# EAGLE design waveshare.v4 (EAGLE 9.6.2)
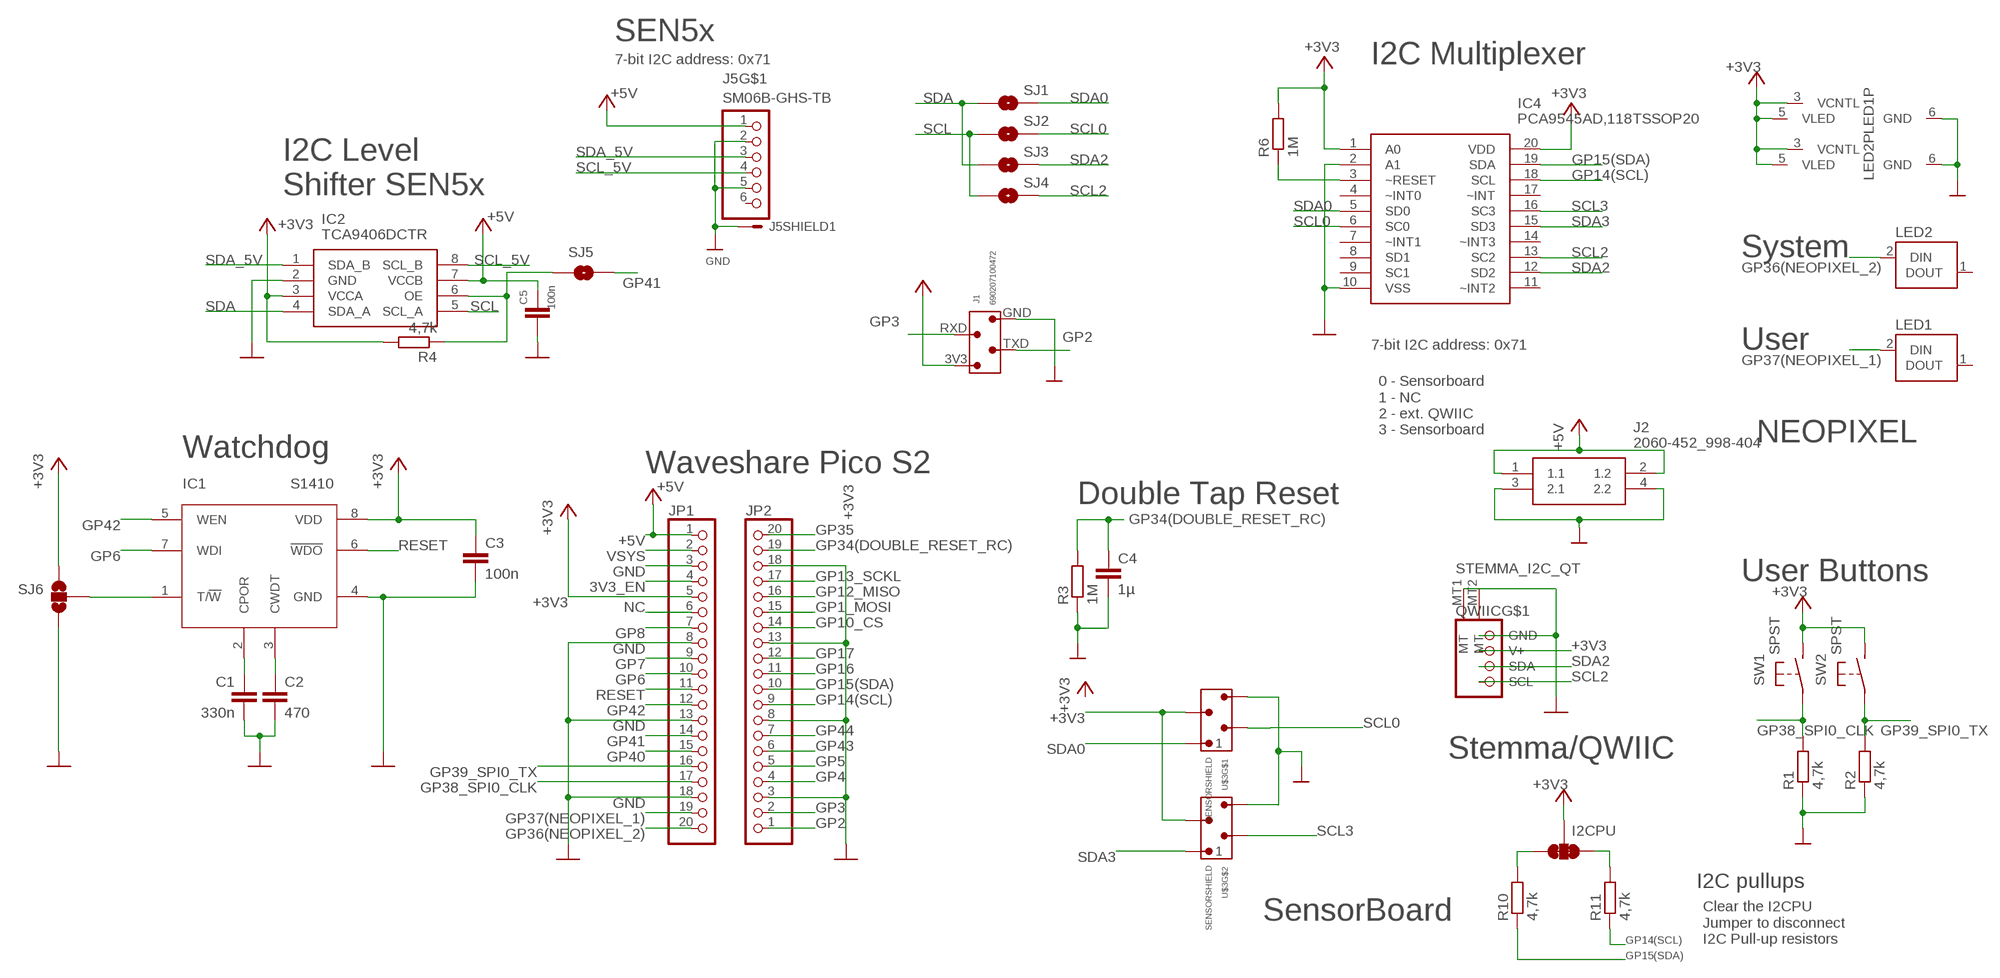
[diagram p0: schematic, sheet 1]

## Parts
C1  330n  C-EUC0603  [C0603]
C2  470  C-EUC0603  [C0603]
C3  100n  C-EUC0603  [C0603]
C4  1µ  C-EUC0603  [C0603]
C5  100n  C-EUC0603  [C0603]
I2CPU  I2C PU  JUMPER-SMT_3_2-NC_TRACE_SILK  [SMT-JUMPER_3_2-NC_TRACE_SILK]
IC1  S1410  [MSOP08]
IC2  TCA9406DCTR  [SOP65P400X130-8N]
IC4  PCA9545AD,118TSSOP20  [TSSOP20]
J1  690207100472  LORASHIELD  [LORASHIELD]
J2  2060-452_998-404  [2060452998404]
J5  SM06B-GHS-TB  JST-PH-06-SMDSMD  [JST-PH-06-SMD]
JP1  PINHD-1X20  [1X20]
JP2  PINHD-1X20  [1X20]
LED1  WS2812WS2812  [WS2812]
LED2  WS2812WS2812  [WS2812]
QWIIC  STEMMA_I2C_QT  [JST_SH4]
R1  4,7k  R-EU_R0603  [R0603]
R2  4,7k  R-EU_R0603  [R0603]
R3  1M  R-EU_R0603  [R0603]
R4  4,7k  R-EU_R0603  [R0603]
R6  1M  R-EU_R0603  [R0603]
R10  4,7k  R-EU_R0603  [R0603]
R11  4,7k  R-EU_R0603  [R0603]
SJ1  SOLDERJUMPERNO  [SJ_2S-NO]
SJ2  SOLDERJUMPERNO  [SJ_2S-NO]
SJ3  SOLDERJUMPERNO  [SJ_2S-NO]
SJ4  SOLDERJUMPERNO  [SJ_2S-NO]
SJ5  SOLDERJUMPERNO  [SJ_2S-NO]
SJ6  SOLDERJUMPER_2WAYTRACE1&2  [SJ_3_TRACE1&2]
SW1  SPST  [DTSM-32S-B]
SW2  SPST  [DTSM-32S-B]
U$3  SENSORSHIELD  [SENSORSHIELD]

## Nets
3V3_EN: JP1.4
+3V3: C3.1 I2CPU.2 IC1.8(VDD) IC2.3(VCCA) IC4.1(A0) IC4.20(VDD) J1.3V3 JP1.5 LED1.3(P:VCNTL) LED1.5(P:VLED) LED2.3(P:VCNTL) LED2.5(P:VLED) QWIIC.2(V+) R4.2 R6.2 SJ6.1 SW1.P$2(S) SW2.P$2(S) U$3.3V3_1 U$3.3V3_2
+5V: C5.1 IC2.7(VCCB) J2.1(1.1) J2.2(1.2) J5.1 JP1.1
GND [lowpower]: C1.2 C2.2 C3.2 C4.2 C5.2 IC1.4(GND) IC2.2(GND) IC4.2(A1) IC4.10(VSS) J1.GND J2.3(2.1) J2.4(2.2) J5.2 J5.5 J5.7(SHIELD1:S) J5.8(SHIELD1:S) JP1.3 JP1.8 JP1.13 JP1.18 JP2.3 JP2.8 JP2.13 JP2.18 LED1.6(P:GND) LED2.6(P:GND) QWIIC.1(GND) QWIIC.MT1(MT) QWIIC.MT2(MT) R1.1 R2.1 R3.1 SJ6.3 U$3.GND_1 U$3.GND_2
GP1_MOSI: JP2.15
GP2: J1.TXD JP2.1
GP3: J1.RXD JP2.2
GP4: JP2.4
GP5: JP2.5
GP6: IC1.7(WDI) JP1.10
GP7: JP1.9
GP8: JP1.7
GP10_CS: JP2.14
GP12_MISO: JP2.16
GP13_SCKL: JP2.17
GP14(SCL): IC4.18(SCL) JP2.9 R11.1
GP15(SDA): IC4.19(SDA) JP2.10 R10.1
GP16: JP2.11
GP17: JP2.12
GP34(DOUBLE_RESET_RC): C4.1 JP2.19 R3.2
GP35: JP2.20
GP36(NEOPIXEL_2): JP1.20 LED2.2( :DIN)
GP37(NEOPIXEL_1): JP1.19 LED1.2( :DIN)
GP38_SPI0_CLK: JP1.17 R1.2 SW1.P$1(P)
GP39_SPI0_TX: JP1.16 R2.2 SW2.P$1(P)
GP40: JP1.15
GP41: JP1.14 SJ5.2
GP42: IC1.5(WEN) JP1.12
GP43: JP2.6
GP44: JP2.7
N$1: IC2.6(OE) R4.1 SJ5.1
N$5: C1.1 IC1.2(CPOR)
N$6: C2.1 IC1.3(CWDT)
N$7: IC1.1(T/!W) SJ6.2
N$8: IC4.3(~RESET) R6.1
N$9: I2CPU.3 R10.2
N$10: I2CPU.1 R11.2
NC: JP1.6
RESET: IC1.6(!WDO) JP1.11
SCL: IC2.5(SCL_A) SJ2.1 SJ4.1
SCL0: IC4.6(SC0) SJ2.2 U$3.SCL0
SCL2: IC4.13(SC2) QWIIC.4(SCL) SJ4.2
SCL3: IC4.16(SC3) U$3.SCL1
SCL_5V: IC2.8(SCL_B) J5.4
SDA: IC2.4(SDA_A) SJ1.1 SJ3.1
SDA0: IC4.5(SD0) SJ1.2 U$3.SDA0
SDA2: IC4.12(SD2) QWIIC.3(SDA) SJ3.2
SDA3: IC4.15(SD3) U$3.SDA1
SDA_5V: IC2.1(SDA_B) J5.3
VSYS: JP1.2
Unconnected: IC4.4(~INT0) IC4.7(~INT1) IC4.8(SD1) IC4.9(SC1) IC4.11(~INT2) IC4.14(~INT3) IC4.17(~INT) J5.6 LED1.1( :DOUT) LED2.1( :DOUT)

## Notes on the sheet
- SEN5x
- 7-bit I2C address: 0x71 | I2C Multiplexer
- I2C Level
  Shifter SEN5x
- System
- 7-bit I2C address: 0x71 | User
- 0 - Sensorboard
  1 - NC
  2 - ext. QWIIC
  3 - Sensorboard
- NEOPIXEL
- Watchdog
- Waveshare Pico S2
- Double Tap Reset
- User Buttons
- Stemma/QWIIC
- I2C pullups
- SensorBoard
- Clear the I2CPU 
  Jumper to disconnect
  I2C Pull-up resistors

## Library data of the parts
C1-C5 = rcl:C-EU: CAPACITOR, European symbol; SPICEPREFIX: C
I2CPU = SparkFun-Jumpers:JUMPER-SMT_3_2-NC_TRACE: Normally closed trace jumper (2 of 2 connections) This jumper has a trace between all three pads so they are normally closed (NC). Use a razor knife to open the connection(s). For best results follow the IPC guidelines for cutting traces: Cutout at least 0.063 mm (0.005 in). Remove all loose material to clean up the cut area. Seal the cut with an approved epoxy. Reapply solder to reclose the connection(s).
IC1 = S1410:S1410
IC2 = SamacSys_Parts:TCA9406DCTR: 2-Bit Bidirectional 1-MHz I2C Bus and SMBus Voltage-Level Shifter Source: Datasheet <http://www.ti.com/lit/ds/symlink/tca9406.pdf>; DESCRIPTION: 2-Bit Bidirectional 1-MHz I2C Bus and SMBus Voltage-Level Shifter; HEIGHT: 1.3mm; MANUFACTURER_NAME: Texas Instruments; MANUFACTURER_PART_NUMBER: TCA9406DCTR; MOUSER_PART_NUMBER: 595-TCA9406DCTR; MOUSER_PRICE-STOCK: https://www.mouser.co.uk/ProductDetail/Texas-Instruments/TCA9406DCTR?qs=Ze4%2FuFuz19L6Yntu0RTUyw%3D%3D
IC4 = HSW_ATM-IC:PCA9545AD,118: 4-channel I2C-bus switch with interrupt logic and reset Source: Datasheet
J1 = LoRaShieldE5:LORASHIELD: WR-MM Transition Connector KIND PROPERTIES: Pitch 2.54 mm Gender:Transition MATERIAL PROPERTIES: Insulator Material:PBT Insulator Flammability Rating UL94 V-0 Insulator Color:Red Contact Material :Phosphor Bronze Contact Plating :Mat Tin over Nickel Contact Type: Stamped GENERAL PROPERTIES: Operating Temperature:-40 °C up to +105 °C Compliance Lead free / RoHS ELECTRICAL PROPERTIES: IR 1:1 A Working Voltage 100 V (AC) Withstanding Voltage:500 V (AC) Contact Resistance: 10 mΩ Insulation Resistance:1000 MΩ PACKAGING PROPERTIES: cULus Approval:E323964 Packaging :Tube <https://katalog.we-online.com/media/images/v2/o33156v209%20Family_WR-MM_69020710xx72.jpg> Details see: https://katalog.we-online.com/en/em/MM_TRANSITION_CONNECTOR_69020710XX72 Updated by Yingchun,Shan 2019-10-28 2019 (C) Würth Elektronik; CONTACT-RESISTANCE: 10mOhm; DATASHEET-URL: https://www.we-online.com/catalog/datasheet/690207100472.pdf; GENDER: Transition; IR: 1A; L: 8.51mm; PACKAGING: Tube; PART-NUMBER: 690207100472; PINS: 4; PITCH: 2.54; TYPE: Straight; WORKING-VOLTAGE: 100V(AC)
J2 = 2060-452_998-404:2060-452_998-404: SMD PCB terminal block; push-button; 0.75 mm; Pin spacing 4 mm; 2-pole; Push-in CAGE CLAMP; in tape-and-reel packaging Source: Datasheet <https://www.wago.com/2060-452/998-404>; ARROW_PART_NUMBER: 2060-452/998-404; ARROW_PRICE-STOCK: https://www.arrow.com/en/products/2060-452998-404/wago-kontakttechnik-gmbh?region=nac; DESCRIPTION: SMD PCB terminal block; push-button; 0.75 mm; Pin spacing 4 mm; 2-pole; Push-in CAGE CLAMP; in tape-and-reel packaging; HEIGHT: 4.5mm; MANUFACTURER_NAME: Wago; MANUFACTURER_PART_NUMBER: 2060-452/998-404
J5 = HSW_ATM-Connector_JST:JST-PH-06-SMD
JP1 JP2 = pinhead:PINHD-1X20: PIN HEADER
LED1 LED2 = WS2812:WS2812
QWIIC = microbuilder:STEMMA_I2C
R1-R4 R6 R10 R11 = rcl:R-EU_: RESISTOR, European symbol; SPICEPREFIX: R
SJ1-SJ5 = HSW_ATM-Passives:SOLDERJUMPER: Solder Jumper Standard SMD solder jumper. Used to automate production. Two varients : Normally Open and Normally Closed are the same, but have different paste layers. NC will have a large amount of paste and should jumper during reflow.
SJ6 = HSW_ATM-Passives:SOLDERJUMPER_2WAY: Solder Jumper 2 way solder jumper
SW1 SW2 = HSW_ATM-Passives:SPST
U$3 = sensorshield:SENSORSHIELD

## Net classes
1 highpower: width 0.406 mm, drill 0.483 mm
2 lowpower: width 0.152 mm, drill 0.3 mm

## Board
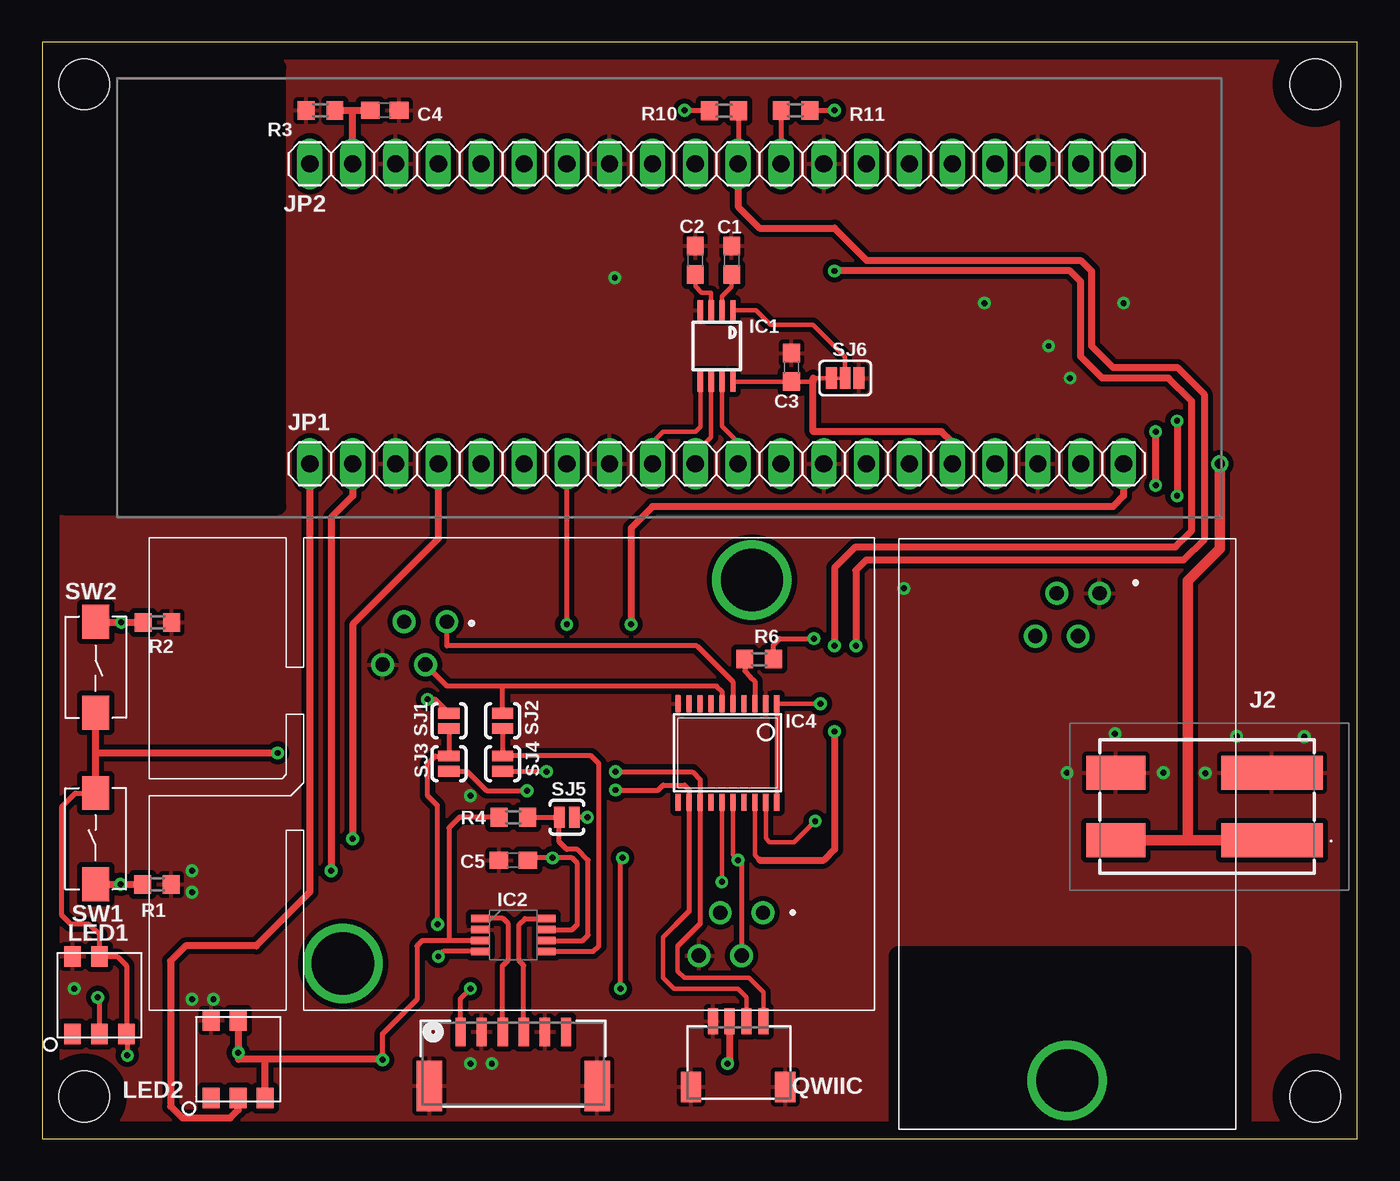
[diagram p1: board, top side]
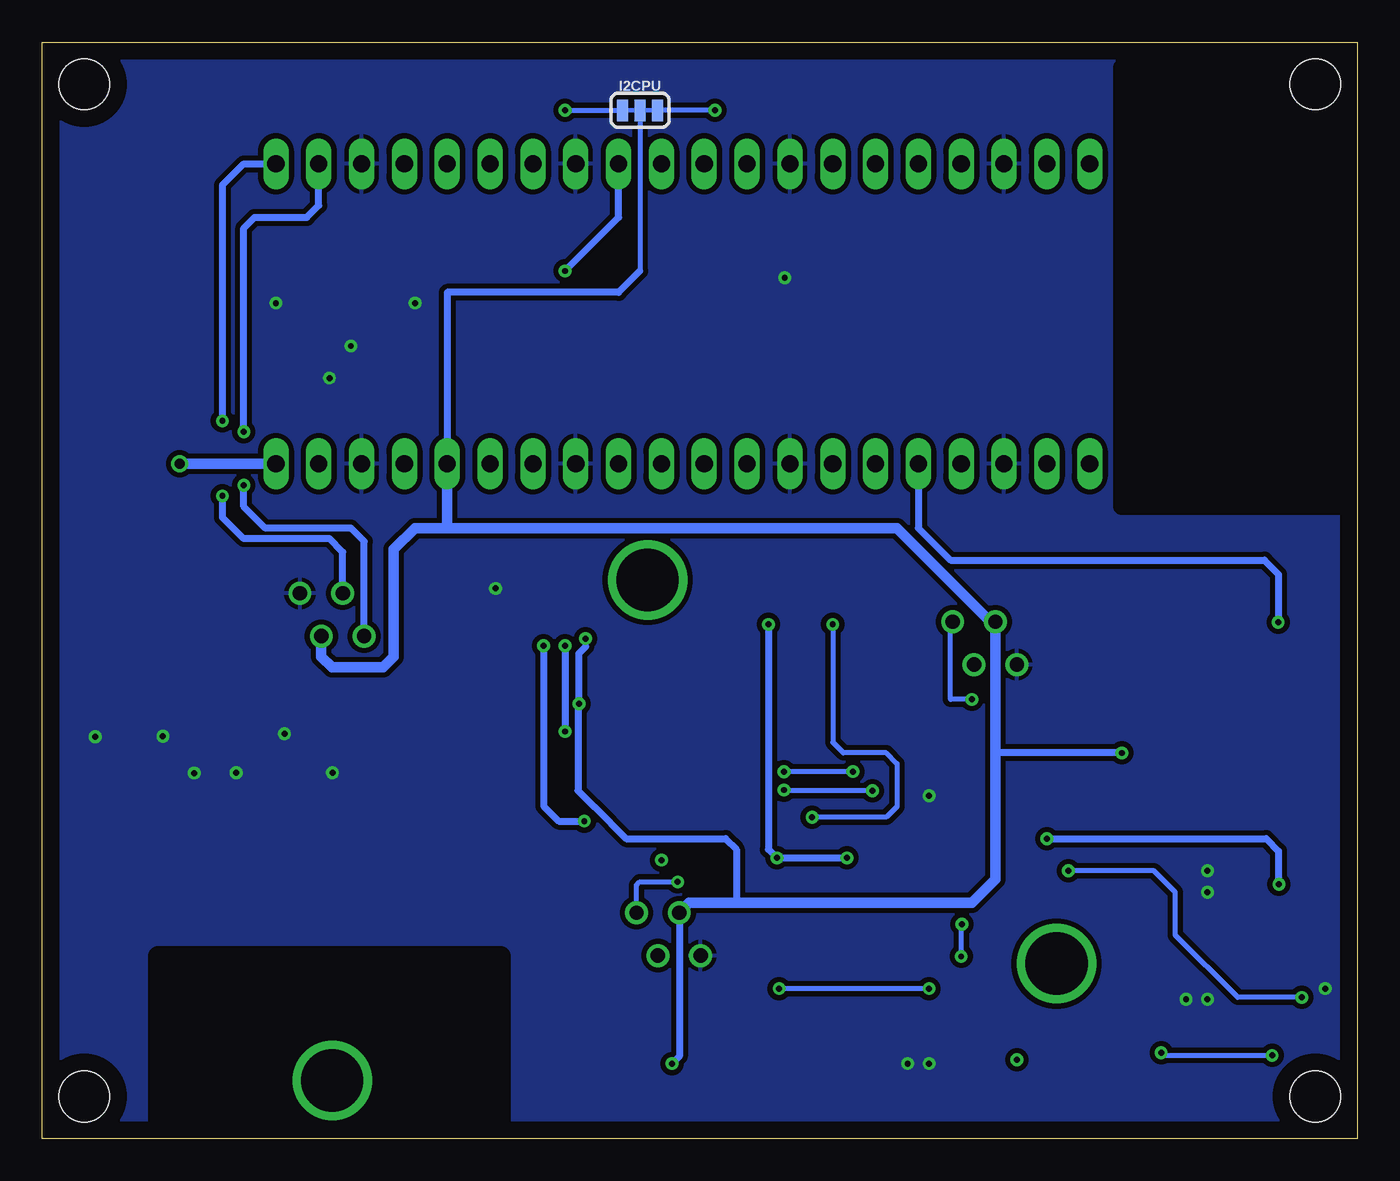
[diagram p2: board, bottom side, seen from below]

Size 78 x 65 mm. Coordinates in mm from the lower left corner, seen from the top.
Outline: 0,0 78,0 78,65 0,65 0,0
Copper layers (1*16): Top 0.035mm / dielectric 1.5mm / Bottom 0.035mm
Design rules "default *": minimum track width 3mil, minimum drill 0.3mm, track to track 6mil, track to pad 6mil, pad to pad 6mil, via to via 6mil, smd to smd 6mil, copper to edge 40mil, drill to drill 6mil, minimum pad ring 10mil, minimum via ring 8mil, stop-mask expansion 4mil, vias tented up to drill 0.3mm, thermal gap 10mil
Holes 3 mm at 2.5,2.5 75.5,2.5 75.5,62.5 2.5,62.5
tRestrict: area 1.3,37.5 to 14,63.5; area 50.8,0.6 to 71.1,10.8
bRestrict: area 1.3,37.5 to 14,63.5; area 50.8,0.6 to 71.1,10.8

### Footprints (pad centres in the part's own frame; a part is rotated, then mirrored left to right if it is on the bottom)
C0603 = smd 1.1 x 1: 1 -0.85,0; 2 0.85,0
SMT-JUMPER_3_2-NC_TRACE_SILK = smd 0.66 x 1.27: 1 -1.041,0; 2 0,0; 3 1.041,0
MSOP08 = smd 0.3 x 1.2: 1 -0.976,-2.113; 2 -0.326,-2.113; 3 0.324,-2.113; 4 0.974,-2.113; 5 0.974,2.112; 6 0.324,2.112; 7 -0.326,2.112; 8 -0.976,2.112
SOP65P400X130-8N = smd 1.1 x 0.45: 1 -1.95,0.975; 2 -1.95,0.325; 3 -1.95,-0.325; 4 -1.95,-0.975; 5 1.95,-0.975; 6 1.95,-0.325; 7 1.95,0.325; 8 1.95,0.975
TSSOP20 = smd 0.305 x 0.991: 1 -2.925,-2.918; 2 -2.275,-2.918; 3 -1.625,-2.918; 4 -0.975,-2.918; 5 -0.325,-2.918; 6 0.325,-2.918; 7 0.975,-2.918; 8 1.625,-2.918; 9 2.275,-2.918; 10 2.925,-2.918; 11 2.925,2.918; 12 2.275,2.918; 13 1.625,2.918; 14 0.975,2.918; 15 0.325,2.918; 16 -0.325,2.918; 17 -0.975,2.918; 18 -1.625,2.918; 19 -2.275,2.918; 20 -2.925,2.918
LORASHIELD = drill 0.85: 3V3 5.773,10.642; GND 3.233,11.912; RXD 5.773,8.102; TXD 3.233,9.372 | drill 3.7: P$1 32.111,10
2060452998404 = smd 6 x 2: 1 -3.725,2; 3 -3.725,-2 | smd 3.5 x 2: 2 5.525,2; 4 5.525,-2
JST-PH-06-SMD = smd 0.61 x 1.702: 1 -3.125,1.876; 2 -1.875,1.876; 3 -0.625,1.876; 4 0.625,1.876; 5 1.875,1.876; 6 3.125,1.876 | smd 1.5 x 3: 7 -4.975,-1.324; 8 4.975,-1.324
1X20 = drill 1.016 long: 1 -24.13,0; 2 -21.59,0; 3 -19.05,0; 4 -16.51,0; 5 -13.97,0; 6 -11.43,0; 7 -8.89,0; 8 -6.35,0; 9 -3.81,0; 10 -1.27,0; 11 1.27,0; 12 3.81,0; 13 6.35,0; 14 8.89,0; 15 11.43,0; 16 13.97,0; 17 16.51,0; 18 19.05,0; 19 21.59,0; 20 24.13,0
WS2812 = smd 1.2 x 1: 1 -2.3,1.6; 2 -2.3,0; 3 -2.3,-1.6; 5 2.3,0; 6 2.3,1.6
JST_SH4 = smd 0.6 x 1.55: 1 -1.5,2.514; 2 -0.5,2.514; 3 0.5,2.514; 4 1.5,2.514 | smd 1.2 x 1.8: MT1 -2.8,-1.386; MT2 2.8,-1.386
R0603 = smd 1 x 1.1: 1 -0.85,0; 2 0.85,0
SJ_2S-NO = smd 0.635 x 1.27: 1 -0.45,0; 2 0.45,0
SJ_3_TRACE1&2 = smd 0.635 x 1.27: 1 -0.813,0; 2 0,0; 3 0.813,0
DTSM-32S-B = smd 2 x 1.6: P$1 -2.7,0; P$2 2.7,0
SENSORSHIELD = drill 0.85: 3V3_1 15.113,23.019; 3V3_2 33.864,5.77; GND_1 13.843,20.479; GND_2 32.594,3.23; SCL0 16.383,20.479; SCL1 35.134,3.23; SDA0 17.653,23.019; SDA1 36.404,5.77 | drill 3.7: P$1 11.496,2.75; P$2 35.746,25.5

### Placement (x,y rotation side)
C1  40.89,52.07 90 top
C2  38.73,52.07 90 top
C3  44.45,45.72 90 top
C4  20.32,60.96 0 top
C5  27.94,16.51 180 top
I2CPU  42.55,60.96 0 bottom
IC1  40.01,46.99 180 top
IC2  27.94,12.06 0 top
IC4  40.64,22.86 180 top
J1  50.8,35.56 270 top
J2  69.22,19.68 180 top
J5  27.94,4.45 0 top
JP1  40.01,40.01 180 top
JP2  40.01,57.78 180 top
LED1  3.4,8.5 90 top
LED2  11.63,4.7 90 top
QWIIC  41.27,4.45 0 top
R1  6.81,15.06 180 top
R2  6.83,30.61 180 top
R3  16.51,60.96 0 top
R4  27.94,19.05 180 top
R6  42.52,28.42 0 top
R10  40.44,60.93 180 top
R11  44.68,60.96 0 top
SJ1  24.13,24.77 90 top
SJ2  27.3,24.77 90 top
SJ3  24.13,22.23 270 top
SJ4  27.3,22.23 270 top
SJ5  31.11,19.05 0 top
SJ6  47.62,45.09 0 top
SW1  3.17,17.78 90 top
SW2  3.17,27.94 270 top
U$3  6.35,7.62 0 top

### Tracks (layer width: path | path; a pad name or v marks a point on that pad's centre or on a via)
+3V3  (via drill 0.35)
  Top 0.254: IC1.8 C3.1 45.72,44.87 | 45.72,45.09 SJ6.1 | v46.16,25.78 IC4.1 IC4.20
  Top 0.305: 13.23,4.67 13.21,4.7 | IC2.3 24.13,11.74 | 24.13,11.74 22.54,11.74 22.23,11.43 22.23,8.26 20.17,6.2 20.17,4.7 | R6.2 43.37,29.27 43.74,29.64 v45.77,29.64 | SW1.P$2 1.96,20.48 1.17,19.68 1.17,13.23 1.7,12.7 2.77,12.7 3.4,12.07 LED1.5 4.44,10.8 5,10.24 LED1.3 5.05,6.14 v5.05,4.93 | 24.13,11.74 24.13,18.41 24.77,19.05 R4.2
  Top 0.406: JP1.5 53.98,41.27 53.34,41.91 45.72,41.91 45.72,44.87 45.72,45.09 | SW1.P$2 3.17,22.86 | 3.17,22.86 SW2.P$2 | LED2.5 v11.63,5.08 11.63,4.7 13.21,4.7 20.17,4.7 v20.19,4.67 | LED2.3 13.23,4.67 | 3.17,22.86 v13.97,22.86 | QWIIC.2 40.77,4.58 v40.64,4.45
  Bottom 0.305: v45.77,29.64 45.77,29.16 | I2CPU.2 42.55,51.44 | v5.05,4.93 11.48,4.93 v11.63,5.08
  Bottom 0.406: JP1.5 53.98,50.16 43.81,50.16 42.55,51.44 | 45.77,29.16 46.16,28.77 v46.16,25.78 46.23,25.72 46.23,20.62 45.26,19.66 45.24,19.66 43.36,17.78 37.47,17.78 36.83,17.14 36.83,13.97 | v13.97,22.86 21.46,22.86 | U$3.3V3_2 40.21,4.87 v40.64,4.45
  Bottom 0.61: JP1.5 53.98,36.2 | U$3.3V3_2 39.63,13.97 36.83,13.97 22.86,13.97 21.46,15.37 21.46,22.86 U$3.3V3_1 21.75,30.64 27.3,36.2 53.98,36.2 | 53.98,36.2 55.88,36.2 57.15,34.92 57.15,28.57 57.78,27.94 60.81,27.94 61.44,28.57 J1.3V3
+5V  (via drill 0.35, 0.6)
  Top 0.305: IC2.7 31.44,12.39 31.75,12.7 31.75,16.31 31.42,16.64 v30.28,16.64 28.92,16.64 C5.1 | J5.1 24.82,8.3 v25.4,8.89 | v34.29,8.89 34.29,16.64 v34.42,16.64
  Top 0.406: JP1.1 64.14,38.1 63.5,37.47 36.2,37.47 34.92,36.2 v34.92,30.48
  Top 0.61: J2.1 67.94,17.68 | 67.94,17.68 J2.2 | 67.94,17.68 67.94,33.07 69.85,34.98 v69.85,40.01
  Bottom 0.305: v25.4,8.89 v34.29,8.89
  Bottom 0.406: v34.92,30.48 34.92,17.14 v34.42,16.64 v30.28,16.64
  Bottom 0.61: JP1.1 v69.85,40.01
GND  (via drill 0.35)
  other vias: 64.14,49.53 60.96,45.09 55.88,49.53 59.69,46.99 51.1,32.61 33.96,51.03 25.4,20.32 1.91,8.89 8.89,15.88 8.89,14.61 10.16,8.26 8.89,8.26 25.4,4.45 26.67,4.45 66.5,21.69 68.99,21.67 63.63,24 70.84,23.85 74.85,23.83 60.78,21.69
  pour Top (isolate 0.305): 0,0 79.38,0 79.38,66.04 0,66.04
  pour Bottom (isolate 0.305): 0,0 80.64,0 80.64,65.41 0,65.41
GP2  (via drill 0.35)
  Top 0.406: v67.31,42.55 v67.31,38.1
  Bottom 0.406: J1.TXD 60.17,34.77 60.96,35.56 66.04,35.56 67.31,36.83 v67.31,38.1 | JP2.1 66.04,57.78 67.31,56.52 v67.31,42.55
GP3  (via drill 0.35)
  Top 0.406: v66.04,38.73 v66.04,41.91
  Bottom 0.406: J1.RXD 58.9,35.41 59.69,36.2 64.77,36.2 66.04,37.47 v66.04,38.73 | JP2.2 61.59,55.32 62.31,54.61 65.41,54.61 66.04,53.98 v66.04,41.91
GP6
  Top 0.254: IC1.7 40.33,42.22 41.27,41.27 JP1.10
GP14(SCL)  (via drill 0.35)
  Top 0.254: IC4.18 42.27,16.79 42.55,16.51
  Top 0.305: R11.1 43.83,57.8 JP2.9
  Top 0.406: v46.99,51.44 60.96,51.44 61.59,50.8 61.59,46.35 62.87,45.09 66.8,45.09 68.17,43.71 68.17,36.04 67.21,35.08 48.23,35.08 46.99,33.83 v46.99,29.21 | v46.99,24.13 46.99,17.14 46.35,16.51 42.55,16.51
  Bottom 0.406: v46.99,51.44 43.81,54.61 JP2.9 | v46.99,29.21 v46.99,24.13
GP15(SDA)  (via drill 0.35)
  Top 0.254: IC4.19 42.91,17.79 43.13,17.58 44.6,17.58 v45.85,18.82
  Top 0.305: R10.1 41.29,57.8 JP2.10
  Top 0.406: JP2.10 41.27,55.24 42.55,53.98 46.99,53.98 48.9,52.07 61.59,52.07 62.23,51.44 62.23,46.99 63.5,45.72 67.31,45.72 68.91,44.12 68.91,35.51 67.69,34.29 48.87,34.29 48.26,33.68 v48.26,29.21
  Bottom 0.406: v48.26,29.21 48.26,19.71 47.37,18.82 v45.85,18.82
GP34(DOUBLE_RESET_RC)
  Top 0.406: R3.2 18.41,60.96 | 18.41,60.96 C4.1 | JP2.19 18.41,60.96
GP36(NEOPIXEL_2)
  Top 0.406: JP1.20 15.88,14.61 12.7,11.43 8.51,11.43 7.62,10.54 7.62,1.91 8.31,1.22 11.15,1.22 11.63,1.7 LED2.2
GP37(NEOPIXEL_1)  (via drill 0.35)
  Top 0.305: LED1.2 3.4,8.25 3.4,8.26 v3.29,8.37
  Top 0.406: JP1.19 18.41,38.1 17.14,36.83 v17.14,15.88
  Bottom 0.305: v3.29,8.37 7.1,8.37 10.79,12.06 10.79,14.61 12.06,15.88 v17.14,15.88
GP38_SPI0_CLK  (via drill 0.35)
  Top 0.406: SW1.P$1 v4.65,15.08 5.94,15.08 R1.2 | JP1.17 23.5,35.56 18.41,30.48 v18.41,17.78
  Bottom 0.406: v18.41,17.78 5.41,17.78 4.67,17.04 4.67,15.06 v4.65,15.08
GP39_SPI0_TX  (via drill 0.35)
  Top 0.406: R2.2 v4.7,30.61 3.21,30.61 SW2.P$1
  Bottom 0.406: JP1.16 26.04,36.2 24.13,34.29 5.51,34.29 4.67,33.45 4.67,30.63 v4.7,30.61
GP41  (via drill 0.35)
  Top 0.305: JP1.14 v31.11,30.48 | v32.34,19.05 SJ5.2
  Bottom 0.305: v31.11,30.48 31.11,23.5 30.48,22.86 27.94,22.86 27.3,22.23 27.3,19.68 27.94,19.05 v32.34,19.05 32.38,19.05
GP42
  Top 0.254: IC1.5 39.03,42.21 38.73,41.91 36.83,41.91 36.2,41.27 JP1.12
N$1
  Top 0.305: R4.1 SJ5.1 30.66,17.59 31.11,17.14 31.75,17.14 32.38,16.51 32.38,12.06 32.06,11.74 IC2.6
N$5
  Top 0.254: IC1.2 40.33,49.94 40.89,50.51 C1.1
N$6
  Top 0.254: IC1.3 39.68,50.15 39.12,50.15 39.12,50.14 38.73,50.52 C2.1
N$7
  Top 0.254: IC1.1 42.34,49.1 43.18,48.26 45.72,48.26 47.62,46.35 SJ6.2
N$8
  Top 0.305: IC4.3 42.27,27.11 41.99,27.39 41.67,27.71 R6.1
N$9  (via drill 0.35)
  Top 0.305: R10.2 38.12,60.94 v38.1,60.96
  Bottom 0.305: v38.1,60.96 I2CPU.3
N$10  (via drill 0.35)
  Top 0.305: R11.2 v46.99,60.96
  Bottom 0.305: v46.99,60.96 I2CPU.1
RESET
  Top 0.254: IC1.6 39.68,41.59 38.73,40.64 JP1.11
SCL
  Top 0.305: SJ2.1 SJ4.1 27.31,22.68 32.56,22.68 33.02,22.23 33.02,11.43 32.68,11.09 IC2.5
SCL0
  Top 0.305: IC4.6 40.31,26.51 40.01,26.82 27.3,26.82 | 27.3,26.82 24.01,26.82 U$3.SCL0 | SJ2.2 27.3,26.82
SCL2  (via drill 0.35)
  Top 0.254: 37.7,11.4 37.7,9.93 38.1,9.53 41.91,9.53 42.77,8.66 QWIIC.4
  Top 0.305: 37.7,11.4 39.02,12.72 IC4.13 39.02,21.29 38.56,21.74 v34.01,21.74 | SJ4.2 29.91,21.77 v29.92,21.77 v29.91,21.75
  Bottom 0.305: v29.91,21.75 33.9,21.75 33.96,21.69 v34.01,21.74
SCL3  (via drill 0.35)
  Top 0.254: IC4.16 40.97,16.82 v41.27,16.51
  Top 0.305: v41.27,16.51 41.48,16.3 U$3.SCL1
SCL_5V
  Top 0.305: J5.4 28.57,10.27 28.3,10.54 28.3,12.7 28.64,13.04 IC2.8
SDA  (via drill 0.35)
  Top 0.305: SJ1.1 SJ3.1 23.31,22.68 22.86,22.23 22.86,20.32 23.45,19.73 v23.45,12.7 | IC2.4 23.79,11.09 v23.5,10.79
  Bottom 0.305: v23.5,10.79 23.5,12.7 v23.45,12.7
SDA0  (via drill 0.35)
  Top 0.305: IC4.5 40.97,27.08 38.84,29.21 24,29.21 U$3.SDA0 | SJ1.2 23.31,26.04 v22.86,26.04
  Bottom 0.305: v22.86,26.04 24.13,26.04 24.13,30.51 U$3.SDA0
SDA2  (via drill 0.35)
  Top 0.254: 37.57,12.67 36.83,11.94 36.83,9.53 37.47,8.89 41.27,8.89 41.77,8.39 QWIIC.3
  Top 0.305: 37.57,12.67 38.37,13.47 IC4.12 38.37,20.69 38.1,20.95 36.83,20.95 36.54,20.66 v34,20.66 | SJ3.2 25.21,21.77 26.36,20.62 v28.75,20.62
  Bottom 0.305: v28.75,20.62 33.98,20.62 34.01,20.65 v34,20.66
SDA3  (via drill 0.35)
  Top 0.254: v40.31,15.21 v40.31,15.22 IC4.15
  Bottom 0.305: U$3.SDA1 42.75,15.03 42.57,15.21 v40.31,15.21
SDA_5V
  Top 0.305: J5.3 27.3,6.33 27.3,10.24 27.66,10.59 27.66,12.72 27.33,13.06 26.01,13.06 IC2.1

### Text on the board
tDocu: Waveshare / ESP32-S2 LCD | - | + | LoRa E5 | Sensorboard | SEN5x
bDocu: Basisboard Sensoronly + / Waveshare ESP32-S2 LCD / 241229